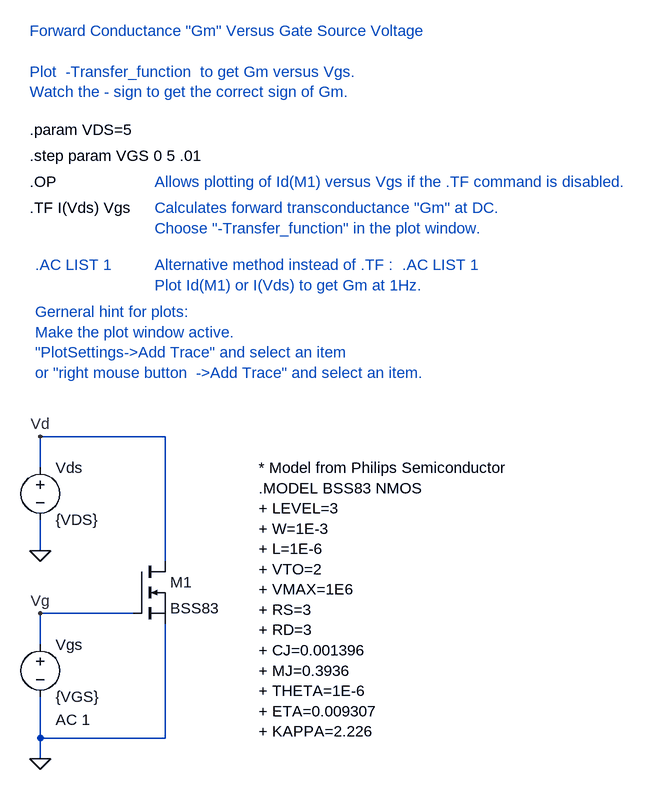
[diagram p0: schematic gm_of_vgs_const_vds.asc]
gm_of_vgs_const_vds.asc, the LTspice schematic file:
Version 4
SHEET 1 1208 724
WIRE -96 384 -96 336
WIRE 96 496 96 672
WIRE 96 672 -96 672
WIRE -96 528 -96 480
WIRE -96 608 -96 672
WIRE -96 704 -96 672
WIRE -96 256 -96 208
WIRE 48 480 -96 480
WIRE -96 208 96 208
WIRE 96 208 96 400
FLAG -96 704 0
FLAG -96 384 0
FLAG -96 208 Vd
FLAG -96 480 Vg
SYMBOL voltage -96 512 R0
WINDOW 123 24 132 Left 0
WINDOW 39 0 0 Left 0
SYMATTR Value2 AC 1
SYMATTR InstName Vgs
SYMATTR Value {VGS}
SYMBOL voltage -96 240 R0
WINDOW 123 24 132 Left 0
WINDOW 39 0 0 Left 0
SYMATTR InstName Vds
SYMATTR Value {VDS}
SYMBOL nmos 48 400 R0
SYMATTR InstName M1
SYMATTR Value BSS83
TEXT -112 -224 Left 0 !.step param VGS 0 5 .01
TEXT -112 -184 Left 0 !.OP
TEXT -112 -144 Left 0 !.TF I(Vds) Vgs
TEXT -104 -56 Left 0 ;.AC LIST 1
TEXT 80 -56 Left 0 ;Alternative method instead of .TF :  .AC LIST 1\nPlot Id(M1) or I(Vds) to get Gm at 1Hz.
TEXT 80 -144 Left 0 ;Calculates forward transconductance "Gm" at DC.\nChoose "-Transfer_function" in the plot window.
TEXT 80 -184 Left 0 ;Allows plotting of Id(M1) versus Vgs if the .TF command is disabled.
TEXT -112 -416 Left 0 ;Forward Conductance "Gm" Versus Gate Source Voltage\n \nPlot  -Transfer_function  to get Gm versus Vgs.  \nWatch the - sign to get the correct sign of Gm.
TEXT -104 16 Left 0 ;Gerneral hint for plots:\nMake the plot window active. \n"PlotSettings->Add Trace" and select an item\nor "right mouse button  ->Add Trace" and select an item.
TEXT -112 -264 Left 0 !.param VDS=5
TEXT 240 256 Left 0 !* Model from Philips Semiconductor\n.MODEL BSS83 NMOS\n+ LEVEL=3\n+ W=1E-3\n+ L=1E-6\n+ VTO=2\n+ VMAX=1E6\n+ RS=3\n+ RD=3\n+ CJ=0.001396\n+ MJ=0.3936\n+ THETA=1E-6\n+ ETA=0.009307\n+ KAPPA=2.226

The netlist it stands for:
* gm_of_vgs_const_vds.asc
Vgs Vg 0 {VGS} AC 1
Vds Vd 0 {VDS}
M1 Vd Vg 0 0 BSS83
.model NMOS NMOS
.model PMOS PMOS
.lib standard.mos
.step param VGS 0 5 .01
.OP
.TF I(Vds) Vgs
* .AC LIST 1
* Alternative method instead of .TF :  .AC LIST 1
* Plot Id(M1) or I(Vds) to get Gm at 1Hz.
* Calculates forward transconductance "Gm" at DC.
* Choose "-Transfer_function" in the plot window.
* Allows plotting of Id(M1) versus Vgs if the .TF command is disabled.
* Forward Conductance "Gm" Versus Gate Source Voltage
* Plot  -Transfer_function  to get Gm versus Vgs.
* Watch the - sign to get the correct sign of Gm.
* Gerneral hint for plots:
* Make the plot window active.
* "PlotSettings->Add Trace" and select an item
* or "right mouse button  ->Add Trace" and select an item.
.param VDS=5
* Model from Philips Semiconductor
.MODEL BSS83 NMOS
+ LEVEL=3
+ W=1E-3
+ L=1E-6
+ VTO=2
+ VMAX=1E6
+ RS=3
+ RD=3
+ CJ=0.001396
+ MJ=0.3936
+ THETA=1E-6
+ ETA=0.009307
+ KAPPA=2.226
.backanno
.end